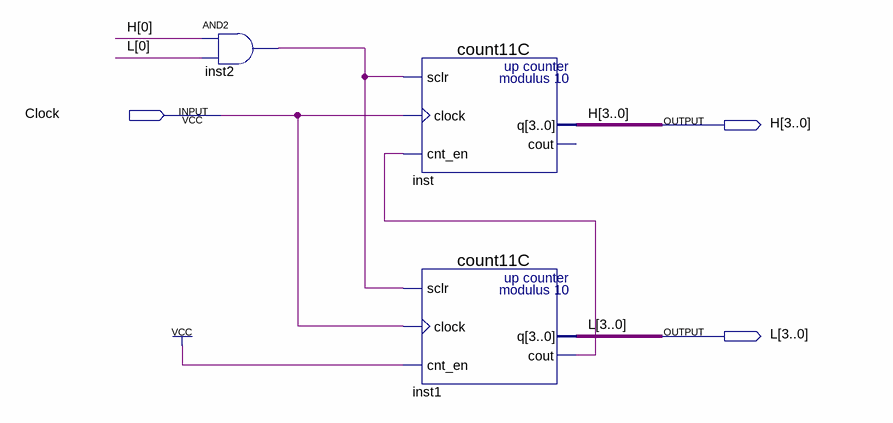
[diagram p0: schematic sheet]
// Quartus schematic cnt11test.bdf as structural Verilog: 3 symbols, 3 pins
module cnt11test (
  input  Clock,
  output [3:0] H,
  output [3:0] L
);

  wire inst1_cout, inst2_out;

  and inst2 (inst2_out, H[0], L[0]);
  count11C inst (.sclr(inst2_out), .clock(Clock), .cnt_en(inst1_cout), .q(H));  // open: cout
  count11C inst1 (.sclr(inst2_out), .clock(Clock), .cnt_en(1'b1), .q(L), .cout(inst1_cout));
endmodule
